# Altium schematic sheet EVK External Connector.SchDoc: =ProjectTitle
size A3; PageSetup: Record=PageOptions|CenterHorizontal=True|CenterVertical=True|PrintScale=1.00|XCorrection=1.00|YCorrection=1.00|PrintKind=0|BorderSize=5000000|LeftOffset=0|BottomOffset=0|Orientation=2|PaperLength=1000|PaperWidth=1000|Scale=100|PaperSource=15|PrintQuality=600|MediaType=1|DitherType=10|PaperKind=Letter|PrintScaleMode=1; Author: Jaime I. Chait; Organization: NWES LLC; Address1: 111 SW 5th Ave, STE 3150; Address2: Portland, OR 97204; SheetNumber: 19; SheetTotal: 19
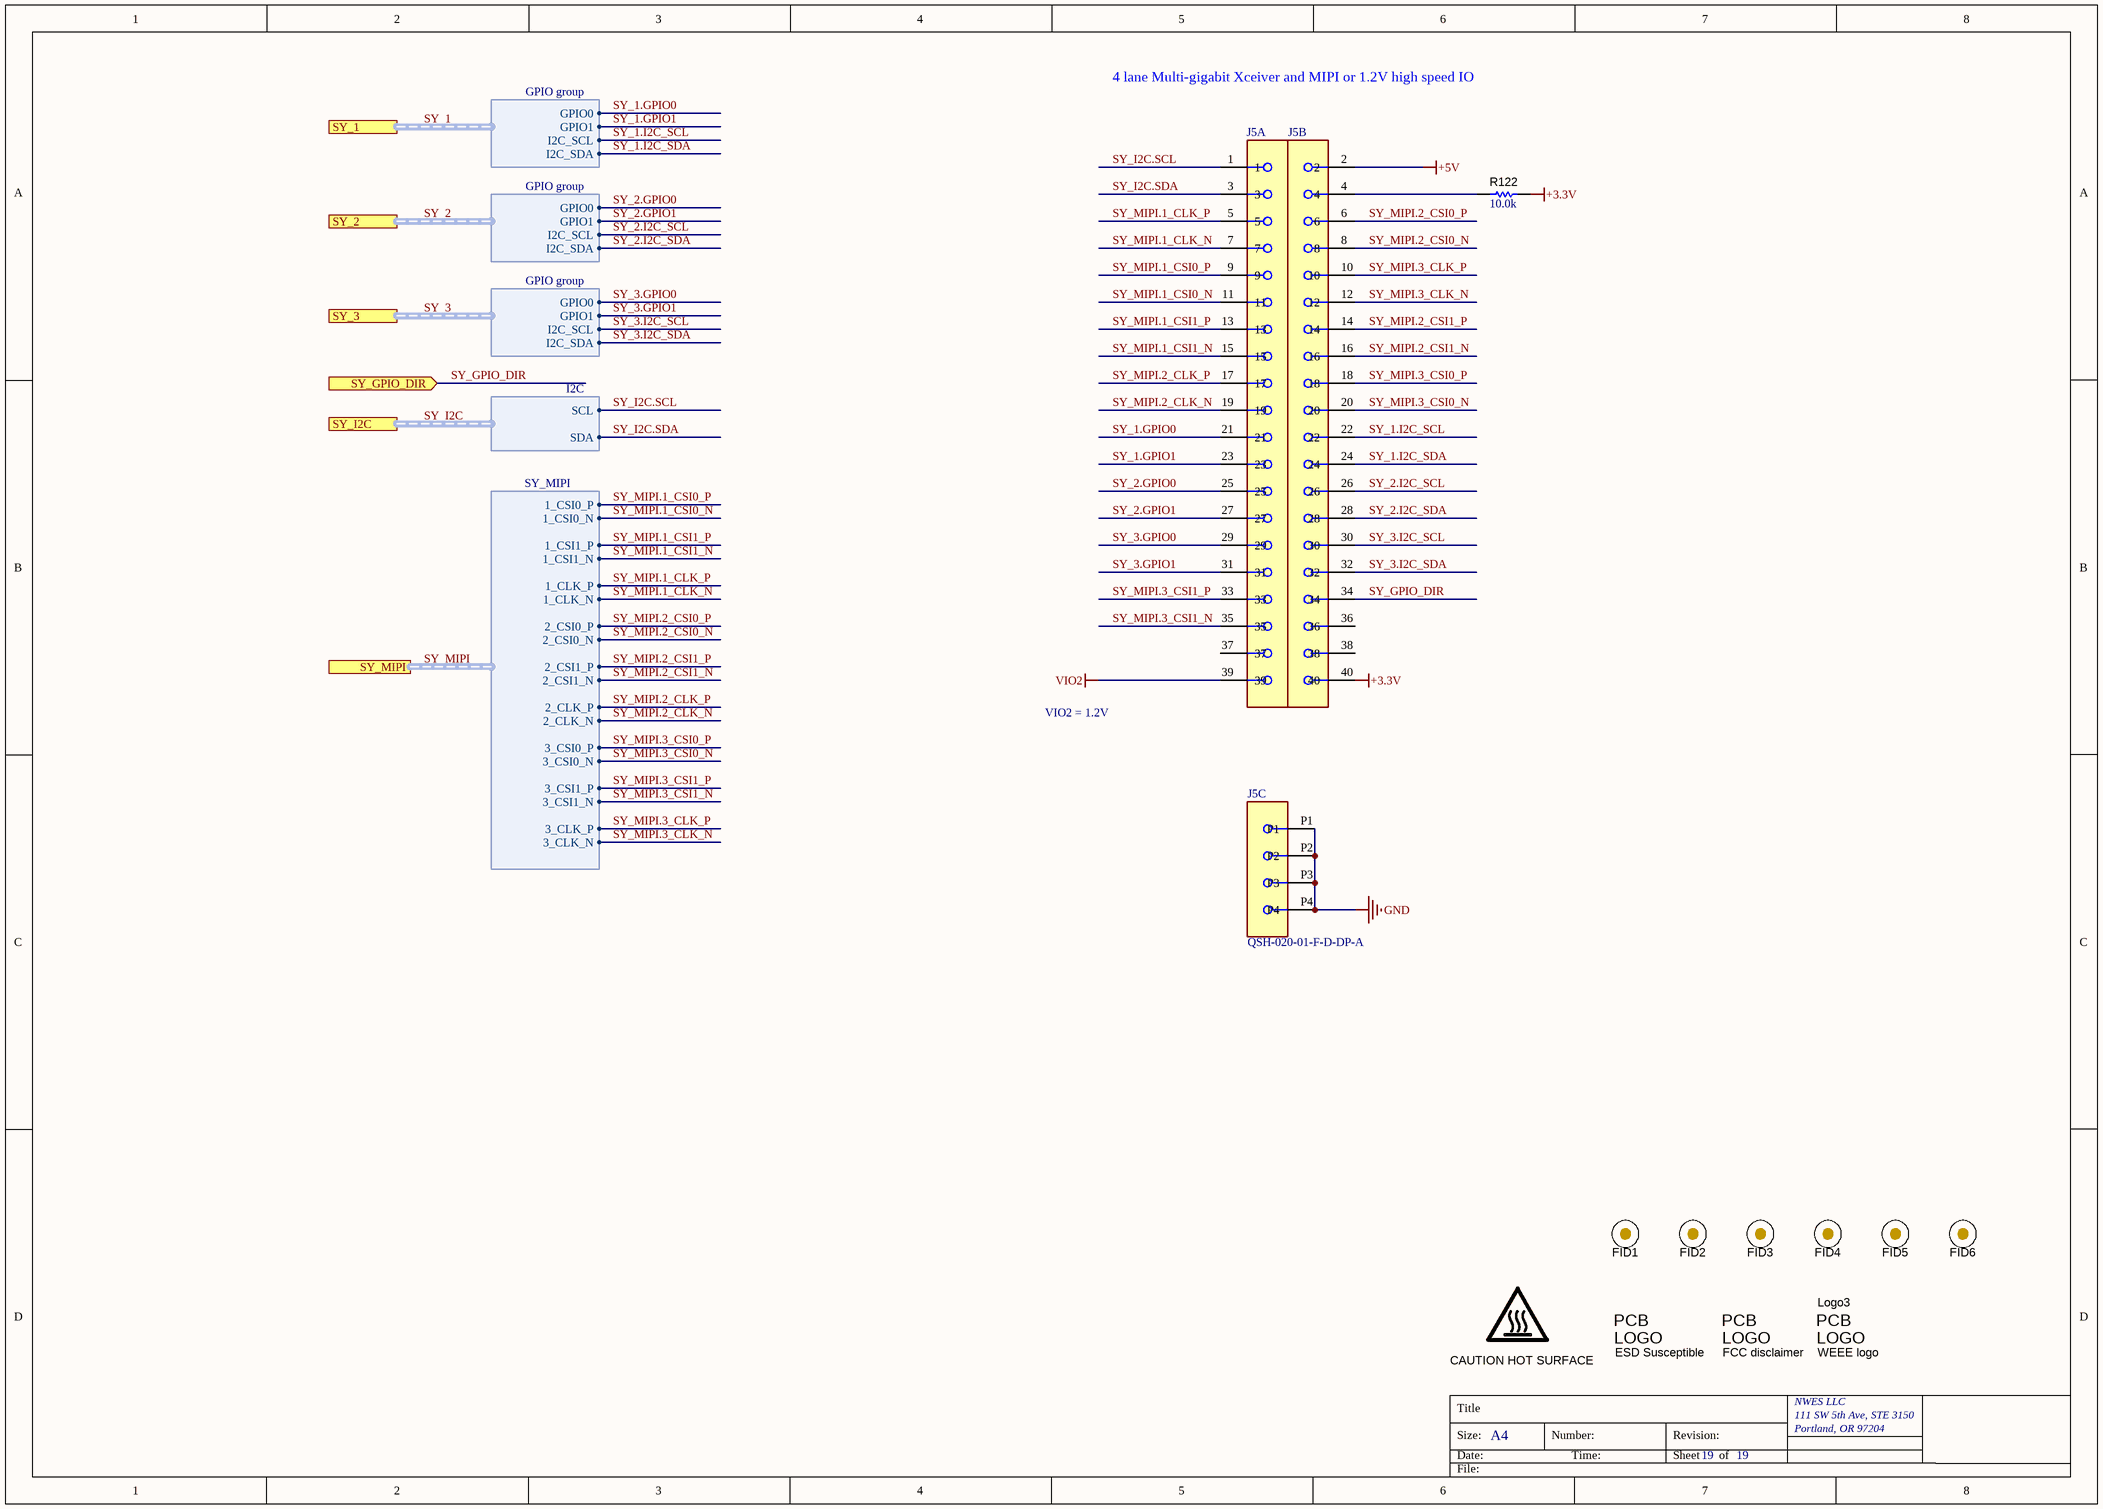
[diagram p0: EVK External Connector.SchDoc]

## Parts
ESD_Susceptible1  ESD Susceptible  [ESD_Overlay_Small]  (no BOM)
FID1  Fiducial  [Fiducial10-20]  (value not drawn)
FID2  Fiducial  [Fiducial10-20]  (value not drawn)
FID3  Fiducial  [Fiducial10-20]  (value not drawn)
FID4  Fiducial  [Fiducial10-20]  (value not drawn)
FID5  Fiducial  [Fiducial10-20]  (value not drawn)
FID6  Fiducial  [Fiducial10-20]  (value not drawn)
J5  QSH-020-01-F-D-DP-A  [FP-QSH-020-01-F-D-DP-A-MFG]  (value not drawn)  (parts A,B,C of 3)
Logo2  FCC disclaimer  [FCC_disclaimer]  (no BOM)
Logo3  WEEE logo  [WEEE_Minimum]  (no BOM)
LOGO4  CAUTION HOT SURFACE  [IEC_HotSurface_Small]  (no BOM)
R122  ValueDisplayed: 10.0k  [0402L]  (hidden comment: CRCW040210K0FKED)

## Ports
SY_1 (harness GPIO group), SY_2 (harness GPIO group), SY_3 (harness GPIO group), SY_GPIO_DIR (in), SY_I2C (harness I2C), SY_MIPI (harness SY_MIPI)

## Harnesses
I2C: SCL, SDA
GPIO group: GPIO0, GPIO1, I2C_SCL, I2C_SDA
SY_MIPI: 1_CSI0_P, 1_CSI0_N, 1_CSI1_P, 1_CSI1_N, 1_CLK_P, 1_CLK_N, 2_CSI0_P, 2_CSI0_N, 2_CSI1_P, 2_CSI1_N, 2_CLK_P, 2_CLK_N, 3_CSI0_P, 3_CSI0_N, 3_CSI1_P, 3_CSI1_N, 3_CLK_P, 3_CLK_N

## Nets
+3.3V: J5.40 R122.1
+5V: J5.2
GND: J5.P1 J5.P2 J5.P3 J5.P4
VIO2: J5.39
SY_1.GPIO0: J5.21 ; port SY_1.GPIO0
SY_1.GPIO1: J5.23 ; port SY_1.GPIO1
SY_1.I2C_SCL: J5.22 ; port SY_1.I2C_SCL
SY_1.I2C_SDA: J5.24 ; port SY_1.I2C_SDA
SY_2.GPIO0: J5.25 ; port SY_2.GPIO0
SY_2.GPIO1: J5.27 ; port SY_2.GPIO1
SY_2.I2C_SCL: J5.26 ; port SY_2.I2C_SCL
SY_2.I2C_SDA: J5.28 ; port SY_2.I2C_SDA
SY_3.GPIO0: J5.29 ; port SY_3.GPIO0
SY_3.GPIO1: J5.31 ; port SY_3.GPIO1
SY_3.I2C_SCL: J5.30 ; port SY_3.I2C_SCL
SY_3.I2C_SDA: J5.32 ; port SY_3.I2C_SDA
SY_GPIO_DIR: J5.34 ; port SY_GPIO_DIR
SY_I2C.SCL: J5.1 ; port SY_I2C.SCL
SY_I2C.SDA: J5.3 ; port SY_I2C.SDA
SY_MIPI.1_CLK_N: J5.7 ; port SY_MIPI.1_CLK_N
SY_MIPI.1_CLK_P: J5.5 ; port SY_MIPI.1_CLK_P
SY_MIPI.1_CSI0_N: J5.11 ; port SY_MIPI.1_CSI0_N
SY_MIPI.1_CSI0_P: J5.9 ; port SY_MIPI.1_CSI0_P
SY_MIPI.1_CSI1_N: J5.15 ; port SY_MIPI.1_CSI1_N
SY_MIPI.1_CSI1_P: J5.13 ; port SY_MIPI.1_CSI1_P
SY_MIPI.2_CLK_N: J5.19 ; port SY_MIPI.2_CLK_N
SY_MIPI.2_CLK_P: J5.17 ; port SY_MIPI.2_CLK_P
SY_MIPI.2_CSI0_N: J5.8 ; port SY_MIPI.2_CSI0_N
SY_MIPI.2_CSI0_P: J5.6 ; port SY_MIPI.2_CSI0_P
SY_MIPI.2_CSI1_N: J5.16 ; port SY_MIPI.2_CSI1_N
SY_MIPI.2_CSI1_P: J5.14 ; port SY_MIPI.2_CSI1_P
SY_MIPI.3_CLK_N: J5.12 ; port SY_MIPI.3_CLK_N
SY_MIPI.3_CLK_P: J5.10 ; port SY_MIPI.3_CLK_P
SY_MIPI.3_CSI0_N: J5.20 ; port SY_MIPI.3_CSI0_N
SY_MIPI.3_CSI0_P: J5.18 ; port SY_MIPI.3_CSI0_P
SY_MIPI.3_CSI1_N: J5.35 ; port SY_MIPI.3_CSI1_N
SY_MIPI.3_CSI1_P: J5.33 ; port SY_MIPI.3_CSI1_P
NetJ5_4: J5.4 R122.2

Not connected (* = marked no-connect by the designer): J5 36 37 38

## Buses and harness runs
harness SY_1 = port SY_1
harness SY_2 = port SY_2
harness SY_3 = port SY_3
harness SY_I2C = port SY_I2C
harness SY_MIPI = port SY_MIPI

## Notes on the sheet
- 4 lane Multi-gigabit Xceiver and MIPI or 1.2V high speed IO
- VIO2 = 1.2V
- Title
- Size:
- Date:
- A4
- Number:
- Time:
- Revision:
- Sheet
- of
- File:
- (in symbol CMP-0074769-1) PCB; LOGO
- (in symbol CMP-0074840-1) PCB; LOGO
- (in symbol CMP-0074847-1) PCB; LOGO

## Library data of the parts
ESD_Susceptible1 = CMP-0074840-1: ESD Susceptible Symbol; Library Reference: Logo; SymbolCreator: a0412235; Lib Reference: ESD_Susceptible; Publisher: Texas Instruments; SymbolVersion: 2011-08-22; Published: 2009-03-03; LatestRevisionDate: 2017-07-06; PartNumber: ESD Susceptible
FID1-FID6 = CMP-0077181-1: Fiducial mark.  There is nothing to buy or mount.; CompType: Fiducial; Manufacturer: N/A; MountType: N/A; PackageReference: N/A; PartNumber: N/A; ClassName: FiducialMark; Library Reference: Fiducial
J5 = CMP-02761-000036-3: CONN DIFF ARRAY RCP 40P SMD GOLD; NexarPartId: 12550277; Manufacturer Lifecycle Status: PRODUCTION; Manufacturer: Samtec; Voltage Rating: 175V; Pitch: 500µm; Voltage Rating (AC): 125V; Gender: Female; Number of Contacts: 40; Depth: 7.24mm; Contact Plating: Gold; Packaging: Bulk; Height: 3.327mm; Contact Material: Bronze, Gold, Nickel; Lifecycle Status: Production; Number of Rows: 2; Termination: Solder; RoHS: Compliant; Max Operating Temperature: 125°C; Lead Free: Lead Free; Orientation: Straight; Housing Color: Black; Housing Material: Polymer; Max Voltage Rating (AC): 125V; Length: 21.27mm; Min Operating Temperature: -55°C; Radiation Hardening: No; Manufacturer Part Number: QSH-020-01-F-D-DP-A
Logo2 = CMP-0074847-1: FCC_disclaimer; Library Reference: Logo; Published: 2009-03-03; Publisher: Texas Instruments; LatestRevisionDate: 2017-07-06; Lib Reference: FCC_disclaimer; PartNumber: FCC disclaimer
Logo3 = CMP-0074769-1: Library Reference: WEEE logo; Lib Reference: WEEE logo; PartNumber: WEEE logo
LOGO4 = CMP-0074837-1: IEC 61010-1 Hot Surface Warning; Library Reference: IEC_HotSurface; SymbolCreator: a0412235; Publisher: Texas Instruments; SymbolVersion: 2011-08-22; Published: 2009-03-03; Lib Reference: IEC_HotSurface; LatestRevisionDate: 2017-07-06; PartNumber: CAUTION HOT SURFACE
R122 = CMP-0025958-3: RES, 10.0 k, 1%, 0.063 W, AEC-Q200 Grade 0, 0402; Manufacturer: Vishay-Dale; Power_W: 63mW; TempCo: 100 ppm/C; Value_Code: 10k0; Value: 10.0k; EIA_Code: E96; Res_ohm: 10k; SizeX_mm: 1; SizeY_mm: 0.5; SizeZ_mm: 0.6; Value2: 0.063W; AEC Qualified: Y; VDC_V: 50V; AEC Category: Q200; AEC Grade: 0; Supplier Part Number 2: 52K6595; Supplier 2: Newark; Supplier Part Number 3: 71-CRCW0402-10K-E3; Supplier 3: Mouser; RoHS: E; Value1: 1%; MountType: SMT; Supplier 1: Digi-Key; PackageReference: 0402; Tolerance_%: 1%; SizeArea_mm2: 0.5; CompType: Resistor; PartNumber: CRCW040210K0FKED; ComponentLink1Description: Datasheet link; Supplier Part Number 1: 541-10.0KLCT-ND; Technology: Thick Film; ComponentLink1URL: http://www.vishay.com/docs/20035/dcrcwe3.pdf